# EAGLE design bbps (EAGLE 5.11)
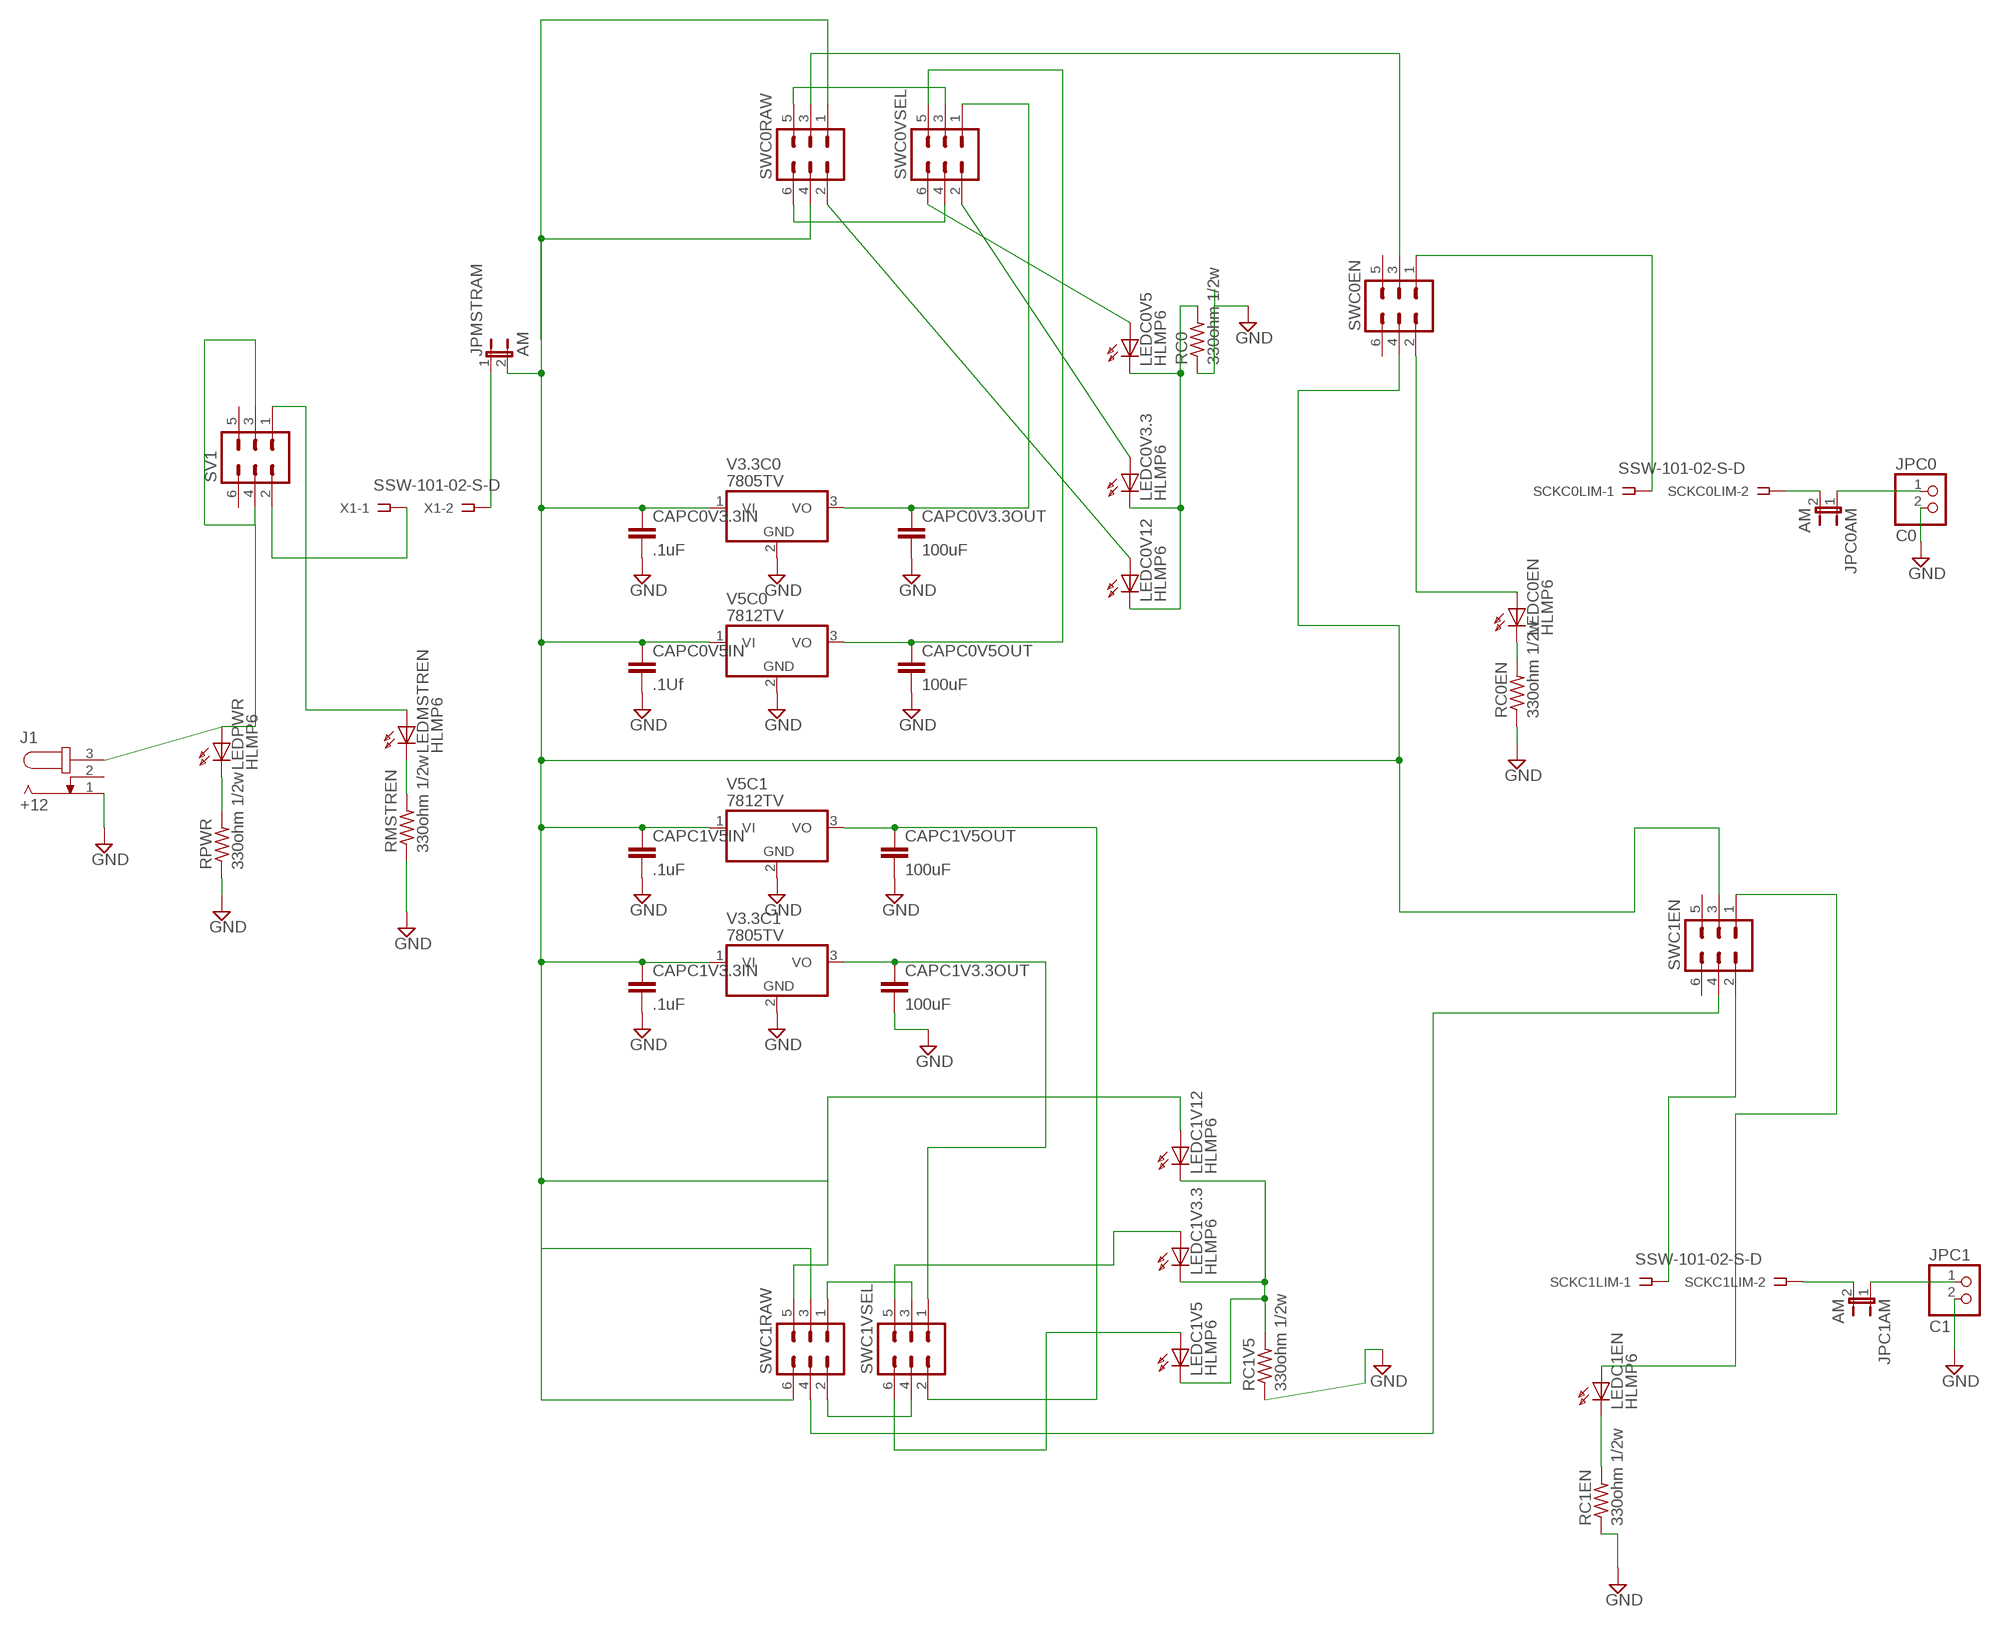
[diagram p0: schematic, sheet 1]

## Parts
CAPC0V3.3IN  .1uF  C5/7.2  [C5B7.2]
CAPC0V3.3OUT  100uF  C5/7.2  [C5B7.2]
CAPC0V5IN  .1Uf  C5/7.2  [C5B7.2]
CAPC0V5OUT  100uF  C5/7.2  [C5B7.2]
CAPC1V3.3IN  .1uF  C5/7.2  [C5B7.2]
CAPC1V3.3OUT  100uF  C5/7.2  [C5B7.2]
CAPC1V5IN  .1uF  C5/7.2  [C5B7.2]
CAPC1V5OUT  100uF  C5/7.2  [C5B7.2]
J1  +12  JACK-PLUG0  [SPC4077]
JPC0  C0  PINHD-1X2  [1X02]
JPC0AM  AM  JP1E  [JP1]
JPC1  C1  PINHD-1X2  [1X02]
JPC1AM  AM  JP1E  [JP1]
JPMSTRAM  AM  JP1E  [JP1]
LEDC0EN  HLMP6  [HLMP6]
LEDC0V3.3  HLMP6  [HLMP6]
LEDC0V5  HLMP6  [HLMP6]
LEDC0V12  HLMP6  [HLMP6]
LEDC1EN  HLMP6  [HLMP6]
LEDC1V3.3  HLMP6  [HLMP6]
LEDC1V5  HLMP6  [HLMP6]
LEDC1V12  HLMP6  [HLMP6]
LEDMSTREN  HLMP6  [HLMP6]
LEDPWR  HLMP6  [HLMP6]
RC0  330ohm 1/2w  R-US_0207/10  [0207/10]
RC0EN  330ohm 1/2w  R-US_0207/10  [0207/10]
RC1EN  330ohm 1/2w  R-US_0207/10  [0207/10]
RC1V5  330ohm 1/2w  R-US_0207/10  [0207/10]
RMSTREN  330ohm 1/2w  R-US_0207/10  [0207/10]
RPWR  330ohm 1/2w  R-US_0207/10  [0207/10]
SCKC0LIM  SSW-101-02-S-D  [SSW-101-02-S-D]
SCKC1LIM  SSW-101-02-S-D  [SSW-101-02-S-D]
SV1  MA03-2  [MA03-2]
SWC0EN  MA03-2  [MA03-2]
SWC0RAW  MA03-2  [MA03-2]
SWC0VSEL  MA03-2  [MA03-2]
SWC1EN  MA03-2  [MA03-2]
SWC1RAW  MA03-2  [MA03-2]
SWC1VSEL  MA03-2  [MA03-2]
V3.3C0  7805TV  [TO220V]
V3.3C1  7805TV  [TO220V]
V5C0  7812TV  [TO220V]
V5C1  7812TV  [TO220V]
X1  SSW-101-02-S-D  [SSW-101-02-S-D]

## Nets
GND: CAPC0V3.3IN.2 CAPC0V3.3OUT.2 CAPC0V5IN.2 CAPC0V5OUT.2 CAPC1V3.3IN.2 CAPC1V3.3OUT.2 CAPC1V5IN.2 CAPC1V5OUT.2 J1.1 JPC0.2 JPC1.2 RC0.1 RC0EN.1 RC1EN.1 RC1V5.1 RMSTREN.1 RPWR.1 V3.3C0.2(GND) V3.3C1.2(GND) V5C0.2(GND) V5C1.2(GND)
MSTREN: J1.3 LEDPWR.A SV1.3 SV1.4
N$1: CAPC1V3.3OUT.1 SWC1VSEL.1 V3.3C1.3(VO)
N$2: LEDMSTREN.K RMSTREN.2
N$3: LEDMSTREN.A SV1.1
N$5: LEDC0V3.3.K LEDC0V5.K LEDC0V12.K RC0.2
N$6: JPMSTRAM.1 X1.2
N$7: LEDPWR.K RPWR.2
N$8: JPC0.1 JPC0AM.1
N$9: JPC1AM.2 SCKC1LIM.2
N$10: JPC0AM.2 SCKC0LIM.2
N$11: SCKC0LIM.1 SWC0EN.1
N$12: LEDC0EN.A SWC0EN.2
N$13: LEDC0EN.K RC0EN.2
N$14: LEDC0V12.A SWC0RAW.2
N$15: SWC0RAW.6 SWC0VSEL.4
N$16: SWC0RAW.5 SWC0VSEL.3
N$17: SWC0EN.3 SWC0RAW.3
N$19: LEDC1V3.3.K LEDC1V5.K LEDC1V12.K RC1V5.2
N$20: CAPC0V3.3OUT.1 SWC0VSEL.1 V3.3C0.3(VO)
N$21: CAPC0V5OUT.1 SWC0VSEL.5 V5C0.3(VO)
N$22: LEDC0V3.3.A SWC0VSEL.2
N$23: LEDC0V5.A SWC0VSEL.6
N$24: SWC1RAW.1 SWC1VSEL.3
N$25: SWC1RAW.2 SWC1VSEL.4
N$26: CAPC1V5OUT.1 SWC1VSEL.2 V5C1.3(VO)
N$27: JPC1.1 JPC1AM.1
N$28: LEDC1EN.K RC1EN.2
N$30: CAPC0V3.3IN.1 CAPC0V5IN.1 CAPC1V3.3IN.1 CAPC1V5IN.1 JPMSTRAM.2 SWC0EN.4 SWC0RAW.1 SWC0RAW.4 SWC1EN.3 SWC1RAW.3 SWC1RAW.6 V3.3C0.1(VI) V3.3C1.1(VI) V5C0.1(VI) V5C1.1(VI)
N$32: LEDC1V3.3.A SWC1VSEL.5
N$34: LEDC1V5.A SWC1VSEL.6
N$36: LEDC1EN.A SWC1EN.1
N$38: SCKC1LIM.1 SWC1EN.2
N$41: SWC1EN.4 SWC1RAW.4
SCKMSTRLIM: SV1.2 X1.1
SWC1VSEL: LEDC1V12.A SWC1RAW.5
Unconnected: J1.2 SV1.5 SV1.6 SWC0EN.5 SWC0EN.6 SWC1EN.5 SWC1EN.6

## Library data of the parts
CAPC0V3.3IN CAPC0V3.3OUT CAPC0V5IN CAPC0V5OUT CAPC1V3.3IN CAPC1V3.3OUT CAPC1V5IN CAPC1V5OUT = capacitor-wima:C: CAPACITOR naming: grid - package width
J1 = con-jack:JACK-PLUG: DC POWER JACK Power Jack, DC, Right Angle, Through Hole, Rated 5A at 16VDC, PC Terminals Distributor: Farnell (www.Farnell.de) Drawing: 84N1161.pdf / 84N1162.pdf Manufacturer: SPC Technology (www.spctechnology.com) Type: SPC4077 / SPC 4078; OC_FARNELL: unknown; OC_NEWARK: unknown
JPC0 JPC1 = pinhead:PINHD-1X2: PIN HEADER
JPC0AM JPC1AM JPMSTRAM = jumper:JP1E: JUMPER
LEDC0EN LEDC0V3.3 LEDC0V5 LEDC0V12 LEDC1EN LEDC1V3.3 LEDC1V5 LEDC1V12 LEDMSTREN LEDPWR = display-hp:HLMP6: LED 2mm horizontal; MF: AGILENT TECHNOLOGIES; MPN: HLMP-6500; OC_FARNELL: 1652490; OC_NEWARK: 40K0088
RC0 RC0EN RC1EN RC1V5 RMSTREN RPWR = resistor:R-US_: RESISTOR, American symbol
SCKC0LIM SCKC1LIM X1 = con-samtec:SSW-101-02-S-D: THROUGH-HOLE .025" SQ POST SOCKET Source: Samtec SSW.pdf; MPN: SSW-101-02-S-D; OC_FARNELL: unknown; OC_NEWARK: 82P1456
SV1 SWC0EN SWC0RAW SWC0VSEL SWC1EN SWC1RAW SWC1VSEL = con-lstb:MA03-2: PIN HEADER; OC_FARNELL: unknown; OC_NEWARK: unknown
V3.3C0 V3.3C1 V5C0 V5C1 = linear:78*: Positive VOLTAGE REGULATOR Source: http://cache.national.com/ds/LM/LM78L05.pdf http://www.fairchildsemi.com/ds/LM/LM7805.pdf

## Board
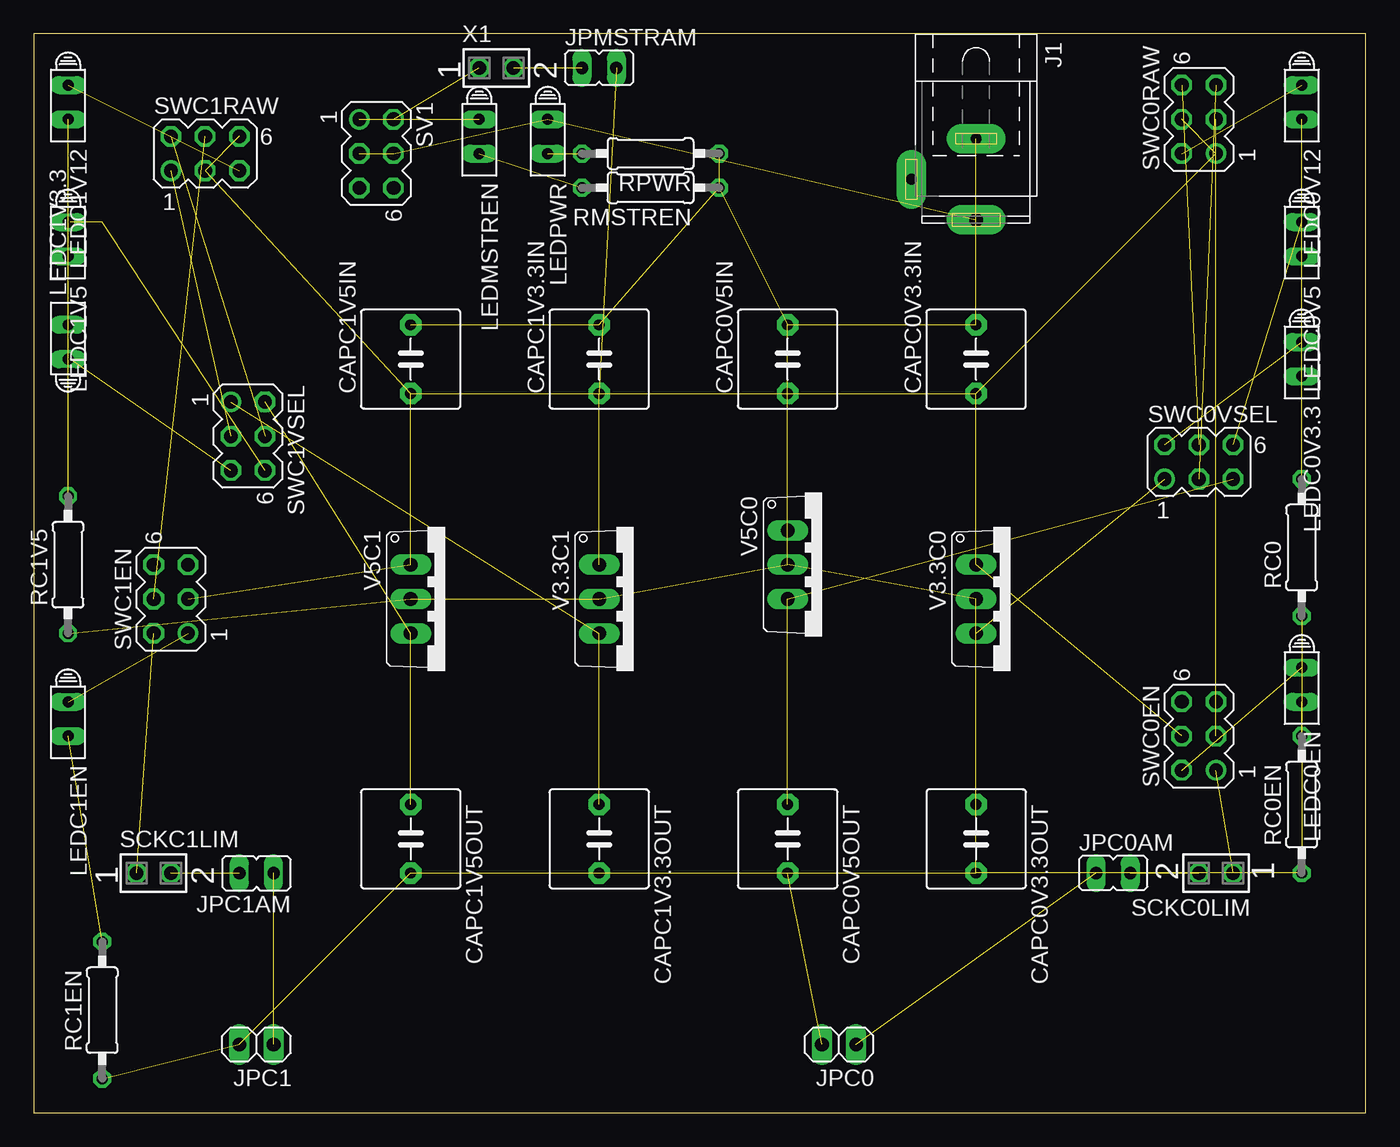
[diagram p1: board, top side]
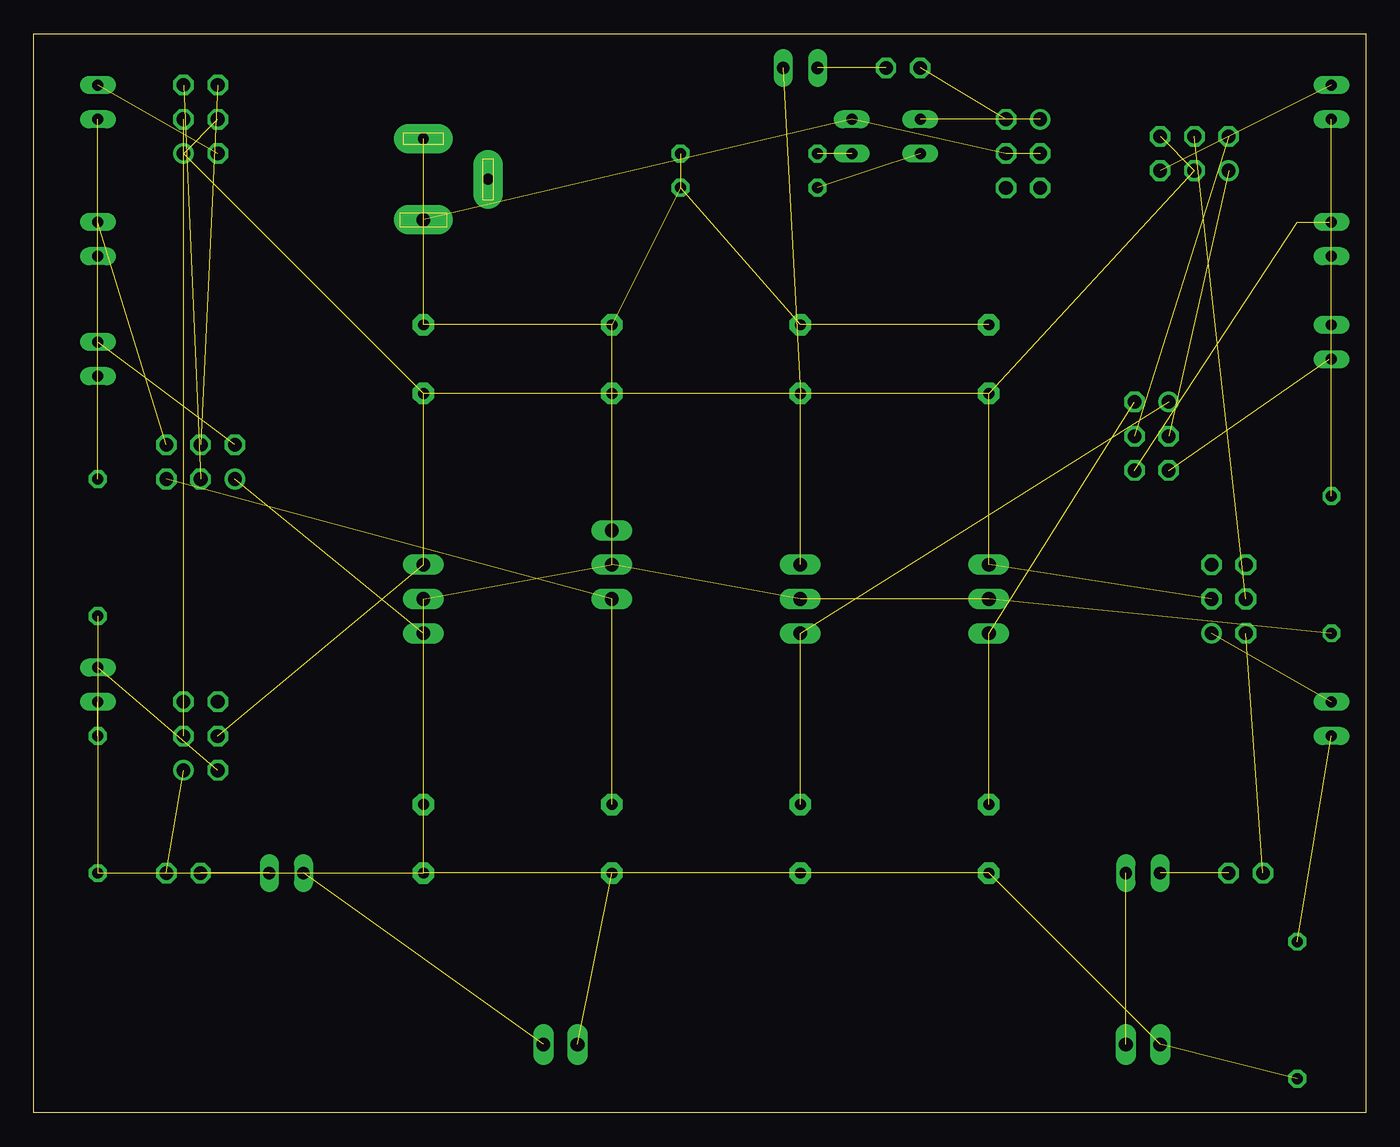
[diagram p2: board, bottom side, seen from below]

Size 98.73 x 80 mm. Coordinates in mm from the lower left corner, seen from the top.
Outline: 0,0 98.73,0 98.73,80 0,80 0,0
Copper layers (1*16): Top 0.035mm / dielectric 1.5mm / Bottom 0.035mm
Design rules "default": minimum track width 10mil, minimum drill 24mil, track to track 8mil, track to pad 8mil, pad to pad 8mil, via to via 8mil, smd to smd 8mil, copper to edge 40mil, drill to drill 8mil, minimum pad ring 10mil, minimum via ring 8mil, stop-mask expansion 4mil, vias tented up to drill 0mil, thermal gap 10mil

### Footprints (pad centres in the part's own frame; a part is rotated, then mirrored left to right if it is on the bottom)
C5B7.2 = drill 0.813 pad 1.6 octagon: 1 -2.54,0; 2 2.54,0
SPC4077 = drill 0.8 pad 2.184 long: 1 -3,0; 2 0,-4.8 | drill 1 pad 2.184 long: 3 3,0
1X02 = drill 1.016 long: 1 -1.27,0; 2 1.27,0
JP1 = drill 0.914 long: 1 0,-1.27; 2 0,1.27
HLMP6 = drill 0.813 long: A -1.27,0; K 1.27,0
0207/10 = drill 0.813 octagon: 1 -5.08,0; 2 5.08,0
SSW-101-02-S-D = drill 1 pad 1.5 octagon: 1 0,-1.27; 2 0,1.27
MA03-2 = drill 1.016 round: 1 -2.54,-1.27 | drill 1.016 octagon: 2 -2.54,1.27; 3 0,-1.27; 4 0,1.27; 5 2.54,-1.27; 6 2.54,1.27
TO220V = drill 1.016 long: 1 -2.54,-2.54; 2 0,-2.54; 3 2.54,-2.54

### Placement (x,y rotation side)
CAPC0V3.3IN  69.85,55.88 90 top
CAPC0V3.3OUT  69.85,20.32 270 top
CAPC0V5IN  55.88,55.88 90 top
CAPC0V5OUT  55.88,20.32 270 top
CAPC1V3.3IN  41.91,55.88 90 top
CAPC1V3.3OUT  41.91,20.32 270 top
CAPC1V5IN  27.94,55.88 90 top
CAPC1V5OUT  27.94,20.32 270 top
J1  69.85,69.22 270 top
JPC0  59.69,5.08 180 top
JPC0AM  80.01,17.78 270 top
JPC1  16.51,5.08 180 top
JPC1AM  16.51,17.78 90 top
JPMSTRAM  41.91,77.47 270 top
LEDC0EN  93.98,31.75 270 top
LEDC0V3.3  93.98,55.88 270 top
LEDC0V5  93.98,64.77 270 top
LEDC0V12  93.98,74.93 270 top
LEDC1EN  2.54,29.21 270 top
LEDC1V3.3  2.54,57.15 90 top
LEDC1V5  2.54,64.77 270 top
LEDC1V12  2.54,74.93 270 top
LEDMSTREN  33.02,72.39 270 top
LEDPWR  38.1,72.39 270 top
RC0  93.98,41.91 90 top
RC0EN  93.98,22.86 90 top
RC1EN  5.08,7.62 90 top
RC1V5  2.54,40.64 90 top
RMSTREN  45.72,68.58 180 top
RPWR  45.72,71.12 180 top
SCKC0LIM  87.63,17.78 90 top
SCKC1LIM  8.89,17.78 270 top
SV1  25.4,71.12 270 top
SWC0EN  86.36,27.94 90 top
SWC0RAW  86.36,73.66 90 top
SWC0VSEL  86.36,48.26 0 top
SWC1EN  10.16,38.1 90 top
SWC1RAW  12.7,71.12 0 top
SWC1VSEL  15.88,50.16 270 top
V3.3C0  72.39,38.1 270 top
V3.3C1  44.45,38.1 270 top
V5C0  58.42,40.64 270 top
V5C1  30.48,38.1 270 top
X1  34.29,77.47 270 top

### Tracks (layer width: path | path; a pad name or v marks a point on that pad's centre or on a via)
GND  (20 unrouted)
MSTREN  (3 unrouted)
N$1  (2 unrouted)
N$2  (1 unrouted)
N$3  (1 unrouted)
N$5  (3 unrouted)
N$6  (1 unrouted)
N$7  (1 unrouted)
N$8  (1 unrouted)
N$9  (1 unrouted)
N$10  (1 unrouted)
N$11  (1 unrouted)
N$12  (1 unrouted)
N$13  (1 unrouted)
N$14  (1 unrouted)
N$15  (1 unrouted)
N$16  (1 unrouted)
N$17  (1 unrouted)
N$19  (3 unrouted)
N$20  (2 unrouted)
N$21  (2 unrouted)
N$22  (1 unrouted)
N$23  (1 unrouted)
N$24  (1 unrouted)
N$25  (1 unrouted)
N$26  (2 unrouted)
N$27  (1 unrouted)
N$28  (1 unrouted)
N$30  (14 unrouted)
N$32  (2 unrouted)
  Bottom 0.406: LEDC1V3.3.A 2.69,55.88
N$34  (2 unrouted)
  Bottom 0.406: 2.69,66.04 LEDC1V5.A
N$36  (1 unrouted)
N$38  (1 unrouted)
N$41  (1 unrouted)
SCKMSTRLIM  (1 unrouted)
SWC1VSEL  (1 unrouted)